# Altium schematic sheet BlockDiagram.SchDoc (part 1 of 3)
size 420 x 297 mm; SheetNumber: 4; SheetTotal: 32
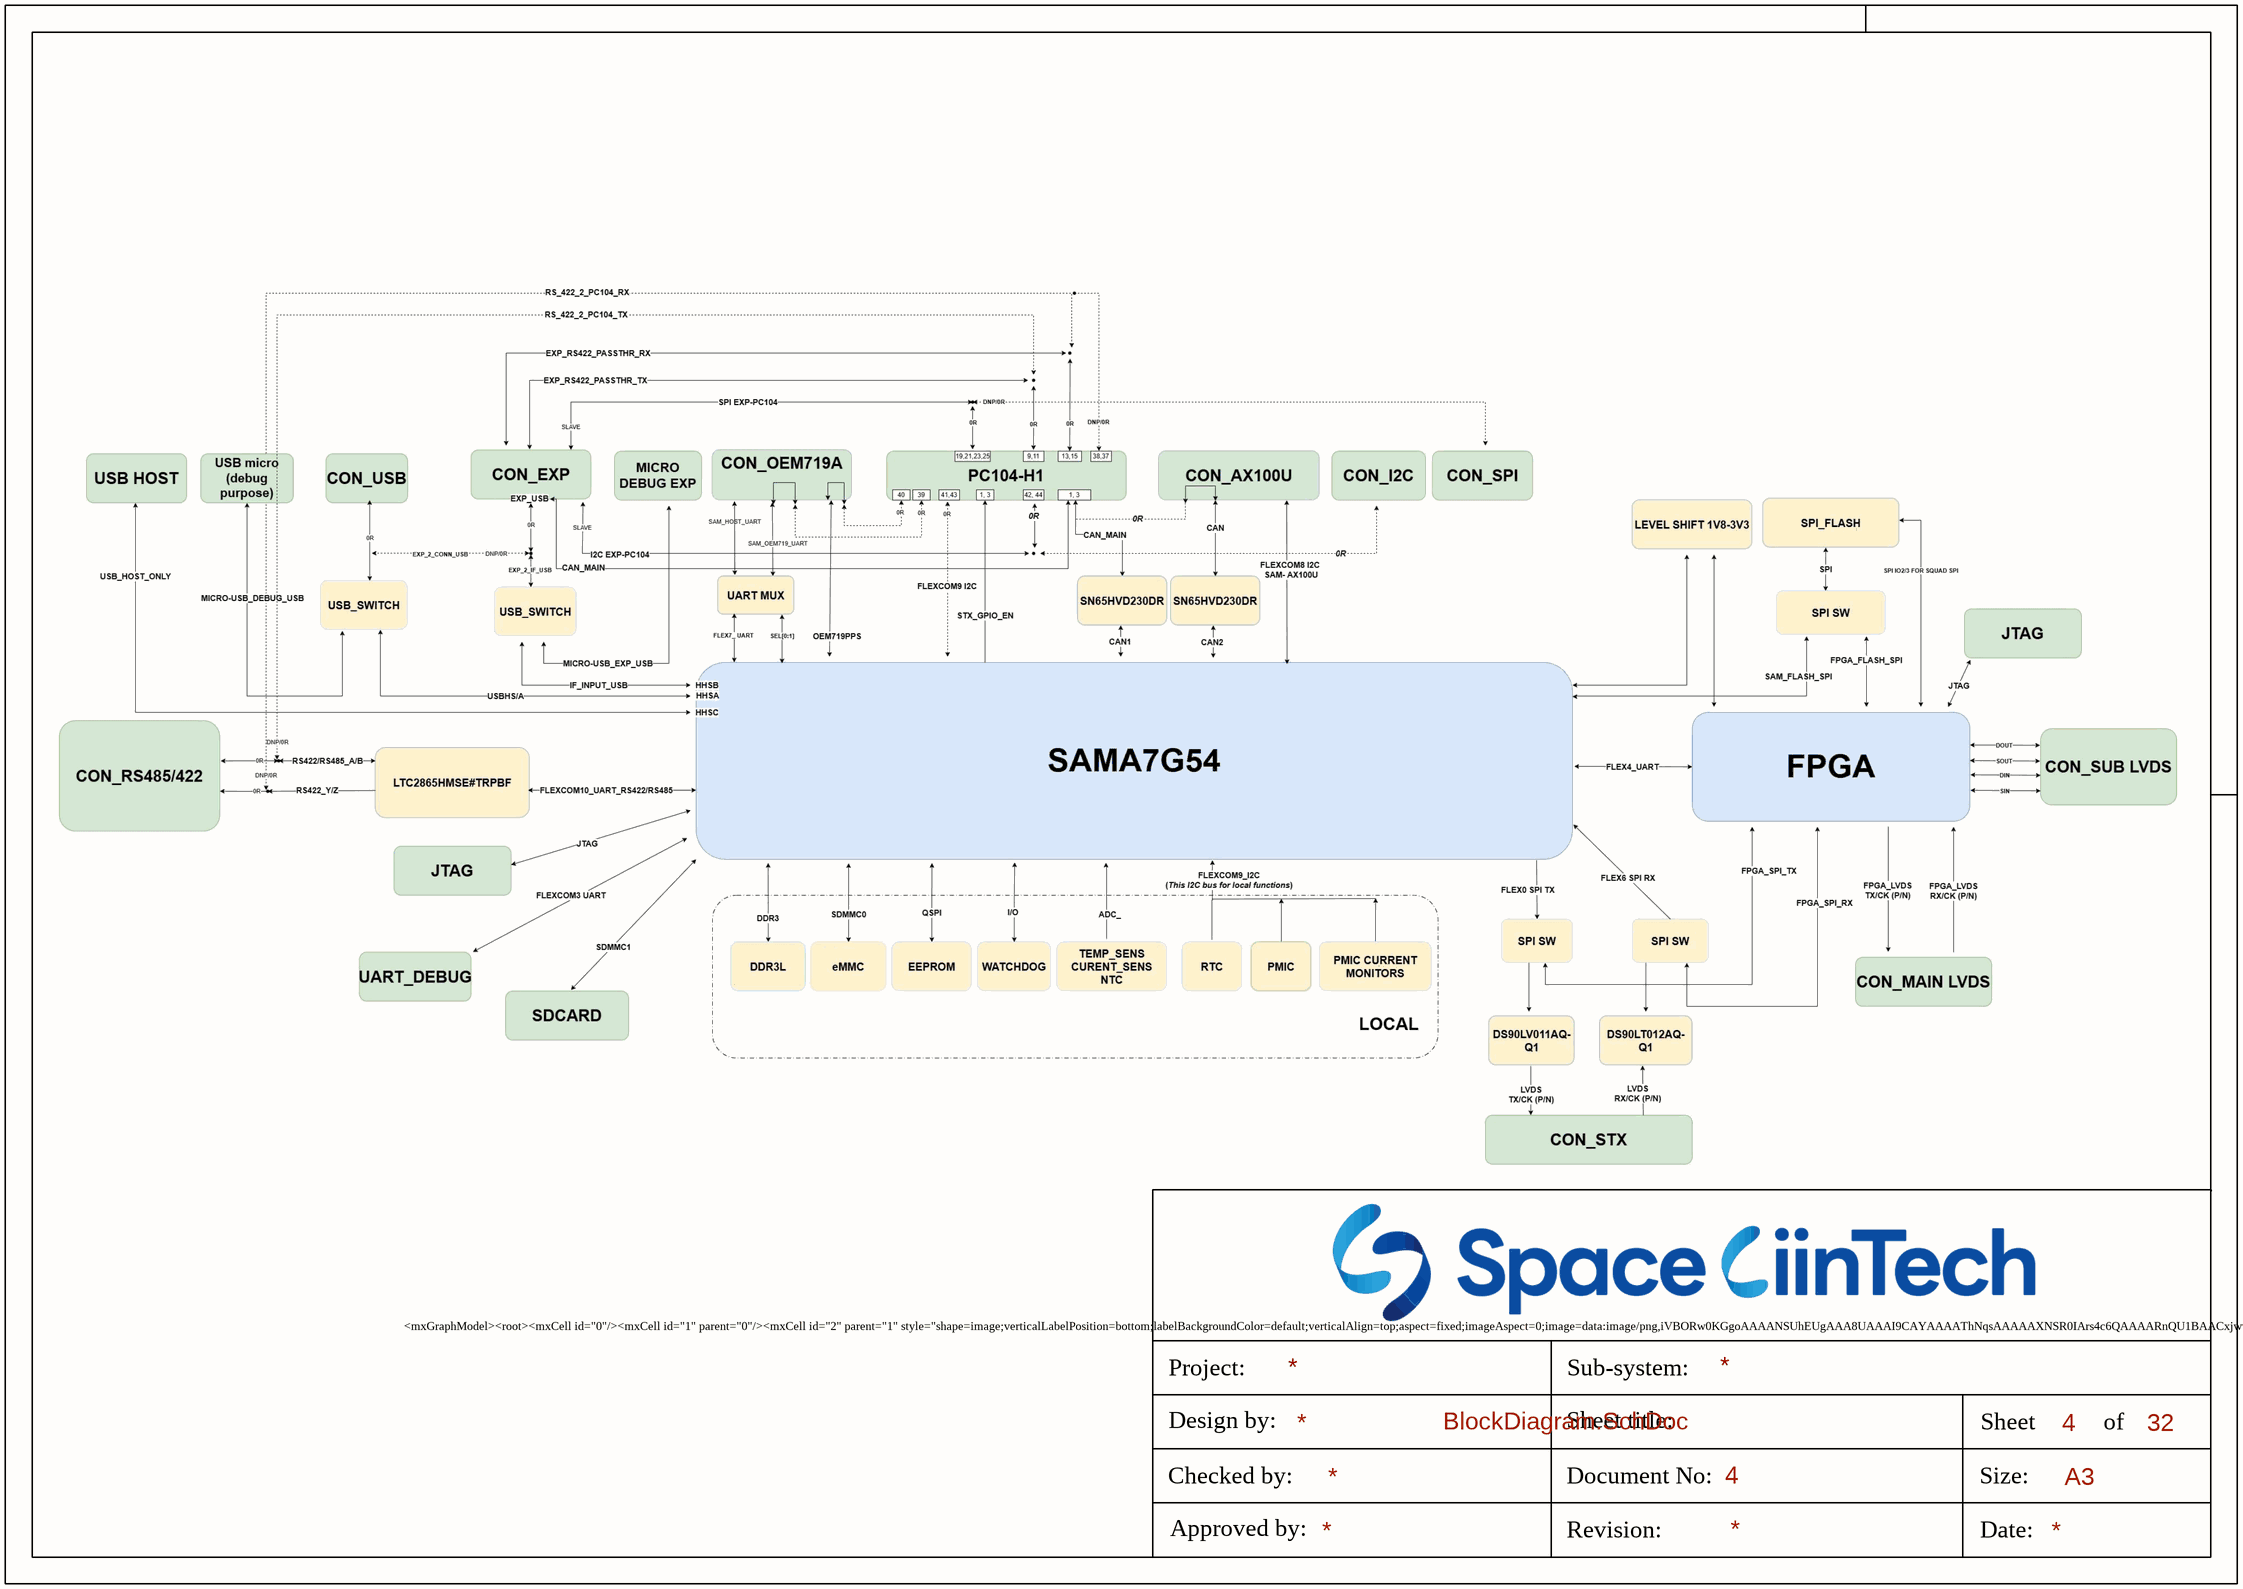
[diagram p0: BlockDiagram.SchDoc]
## Notes on the sheet